# Altium schematic sheet UWB_Control.SchDoc
size A4
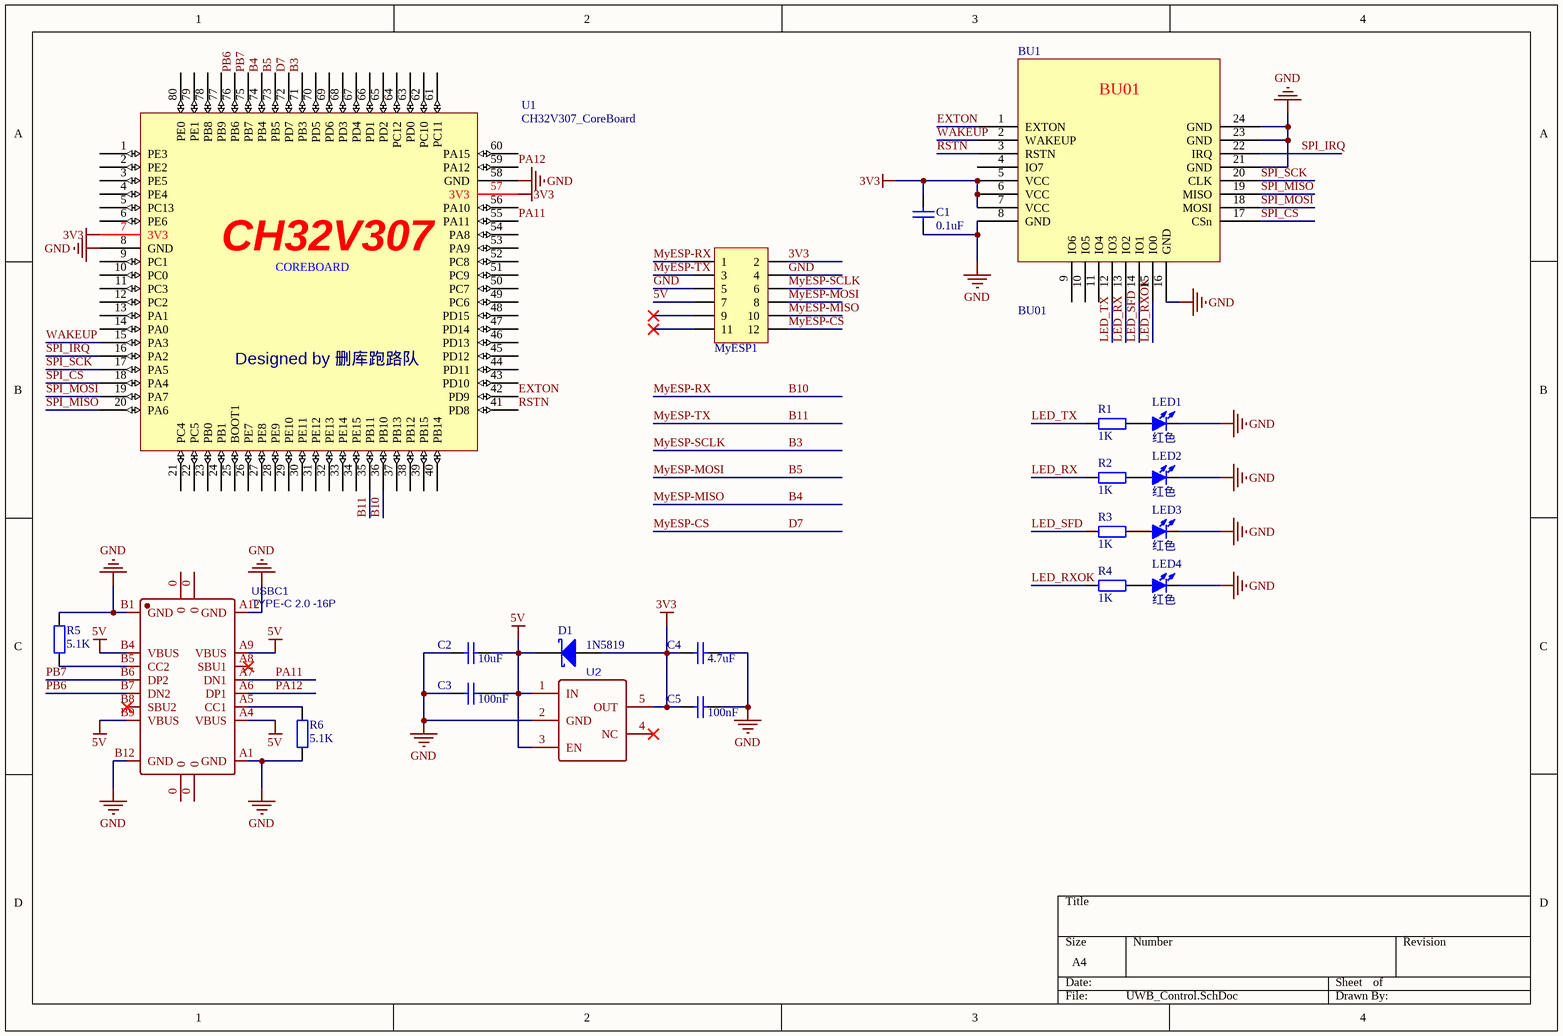
[diagram p0: UWB_Control.SchDoc]

## Parts
BU1  BU01  [BU01 - duplicate]
C1  0.1uF  [C0805_L]
C2  10uF  [C0805_L]
C3  100nF  [C0805_L]
C4  4.7uF  [C0805_L]
C5  100nF  [C0805_L]
D1  1N5819  [SOD-323]
LED1  红色  [LED0805_G]
LED2  红色  [LED0805_G]
LED3  红色  [LED0805_G]
LED4  红色  [LED0805_G]
MyESP1  Header 6X2  [HDR2.54-M-LS-2x6P]  (value not drawn)
R1  1K  [R0805_L]
R2  1K  [R0805_L]
R3  1K  [R0805_L]
R4  1K  [R0805_L]
R5  5.1K  [R0402_L]
R6  5.1K  [R0402_L]
U1  CH32V307_CoreBoard  [CH32V307_PCB]
U2  (no value)  [SOT23-5]
USBC1  TYPE-C 2.0 -16P  [USB-C-SMD_TYPE-C-USB-5]

## Nets
3V3: BU1.5(VCC) BU1.6(VCC) BU1.7(VCC) C1.2 C4.2 C5.2 D1.1(A) MyESP1.2 U1.7(3V3) U1.57(3V3) U2.5(OUT)
5V: C2.1 C3.1 D1.2(K) MyESP1.7 U2.1(IN) U2.3(EN) USBC1.A4(VBUS) USBC1.A9(VBUS) USBC1.B4(VBUS) USBC1.B9(VBUS)
GND: BU1.8(GND) BU1.16(GND) BU1.21(GND) BU1.23(GND) BU1.24(GND) C1.1 C2.2 C3.2 C4.1 C5.1 LED1.2(K) LED2.2(K) LED3.2(K) LED4.2(K) MyESP1.4 MyESP1.5 R5.2 R6.1 U1.8(GND) U1.58(GND) U2.2(GND) USBC1.A1(GND) USBC1.A12(GND) USBC1.B1(GND) USBC1.B12(GND)
B3: MyESP1.6 U1.71(PB3)  [also labelled MyESP-SCLK]
B4: MyESP1.10 U1.74(PB4)  [also labelled MyESP-MISO]
B5: MyESP1.8 U1.73(PB5)  [also labelled MyESP-MOSI]
B10: MyESP1.1 U1.36(PB10)  [also labelled MyESP-RX]
B11: MyESP1.3 U1.35(PB11)  [also labelled MyESP-TX]
D7: MyESP1.12 U1.72(PD7)  [also labelled MyESP-CS]
EXTON: BU1.1(EXTON) U1.42(PD9)
LED_RX: BU1.13(IO2) R2.1
LED_RXOK: BU1.15(IO0) R4.1
LED_SFD: BU1.14(IO1) R3.1
LED_TX: BU1.12(IO3) R1.1
PA11: U1.55(PA11) USBC1.A7(DN1)
PA12: U1.59(PA12) USBC1.A6(DP1)
PB6: U1.76(PB6) USBC1.B7(DN2)
PB7: U1.75(PB7) USBC1.B6(DP2)
RSTN: BU1.3(RSTN) U1.41(PD8)
SPI_CS: BU1.17(CSn) U1.18(PA4)
SPI_IRQ: BU1.22(IRQ) U1.16(PA2)
SPI_MISO: BU1.19(MISO) U1.20(PA6)
SPI_MOSI: BU1.18(MOSI) U1.19(PA7)
SPI_SCK: BU1.20(CLK) U1.17(PA5)
WAKEUP: BU1.2(WAKEUP) U1.15(PA3)
NetLED1_1: LED1.1(A) R1.2
NetLED2_1: LED2.1(A) R2.2
NetLED3_1: LED3.1(A) R3.2
NetLED4_1: LED4.1(A) R4.2
NetR5_1: R5.1 USBC1.B5(CC2)
NetR6_2: R6.2 USBC1.A5(CC1)

Not connected (* = marked no-connect by the designer): BU1 4(IO7) 9(IO6) 10(IO5) 11(IO4); MyESP1 9* 11*; U1 1(PE3) 2(PE2) 3(PE5) 4(PE4) 5(PC13) 6(PE6) 9(PC1) 10(PC0) 11(PC3) 12(PC2) 13(PA1) 14(PA0) 21(PC4) 22(PC5) 23(PB0) 24(PB1) 25(BOOT1) 26(PE7) 27(PE8) 28(PE9) 29(PE10) 30(PE11) 31(PE12) 32(PE13) 33(PE14) 34(PE15) 37(PB13) 38(PB12) 39(PB15) 40(PB14) 43(PD10) 44(PD11) 45(PD12) 46(PD13) 47(PD14) 48(PD15) 49(PC6) 50(PC7) 51(PC9) 52(PC8) 53(PA9) 54(PA8) 56(PA10) 60(PA15) 61(PC11) 62(PC10) 63(PD0) 64(PC12) 65(PD2) 66(PD1) 67(PD4) 68(PD3) 69(PD6) 70(PD5) 77(PB9) 78(PB8) 79(PE1) 80(PE0); U2 4(NC)*; USBC1 0 A8(SBU1)* B8(SBU2)*

## Notes on the sheet
- (in symbol CH32V307_CoreBoard) CH32V307; COREBOARD; Designed by 删库跑路队

## Library data of the parts
C1-C5 = C: 贴片电容/MLCC电容; BOM名称: 无极性贴片电容; 联系卖家，免费查找封装: 唯一出售店铺网址https://shop463601444.taobao.com
D1 = SS14: 肖特基二极管; 属性: 40V/1A; 以赠品形式获赠本封装库的买家，还可联系卖家免费指导AD软件使用: 封装库来自淘宝卖家ID：黄晶宝石; BOM名称: 肖特基二极管
LED1-LED4 = LED-SMD: 贴片LED; 封装库来自淘宝卖家ID：黄晶宝石: 其他店铺购入均为盗版封装库，请立即申请退款，本店现金奖励20~200元; BOM名称: 贴片LED
MyESP1 = Header  6X2: 6*2P接插件; 版权归属: 封装库来自淘宝 ID：黄晶宝石; BOM名称: 6*2P接插件; 学习资源: https://shop463601444.taobao.com
R1-R6 = R: 贴片电阻; 联系卖家，免费查找封装: 唯一出售店铺网址https://shop463601444.taobao.com; BOM名称: 贴片电阻
U2 = RT9013-33
USBC1 = USB2.0 Type-C 16Pin母座: USB2.0 Type-C 母座 16Pin; BOM_Manufacturer: LCSC; BOM_Supplier: LCSC; BOM_Manufacturer Part: -; spicePre: U; spiceSymbolName: TYPE-C 3.1 -16P_C168689